# EasyEDA Pro project 官方红板.epro, board 2.0
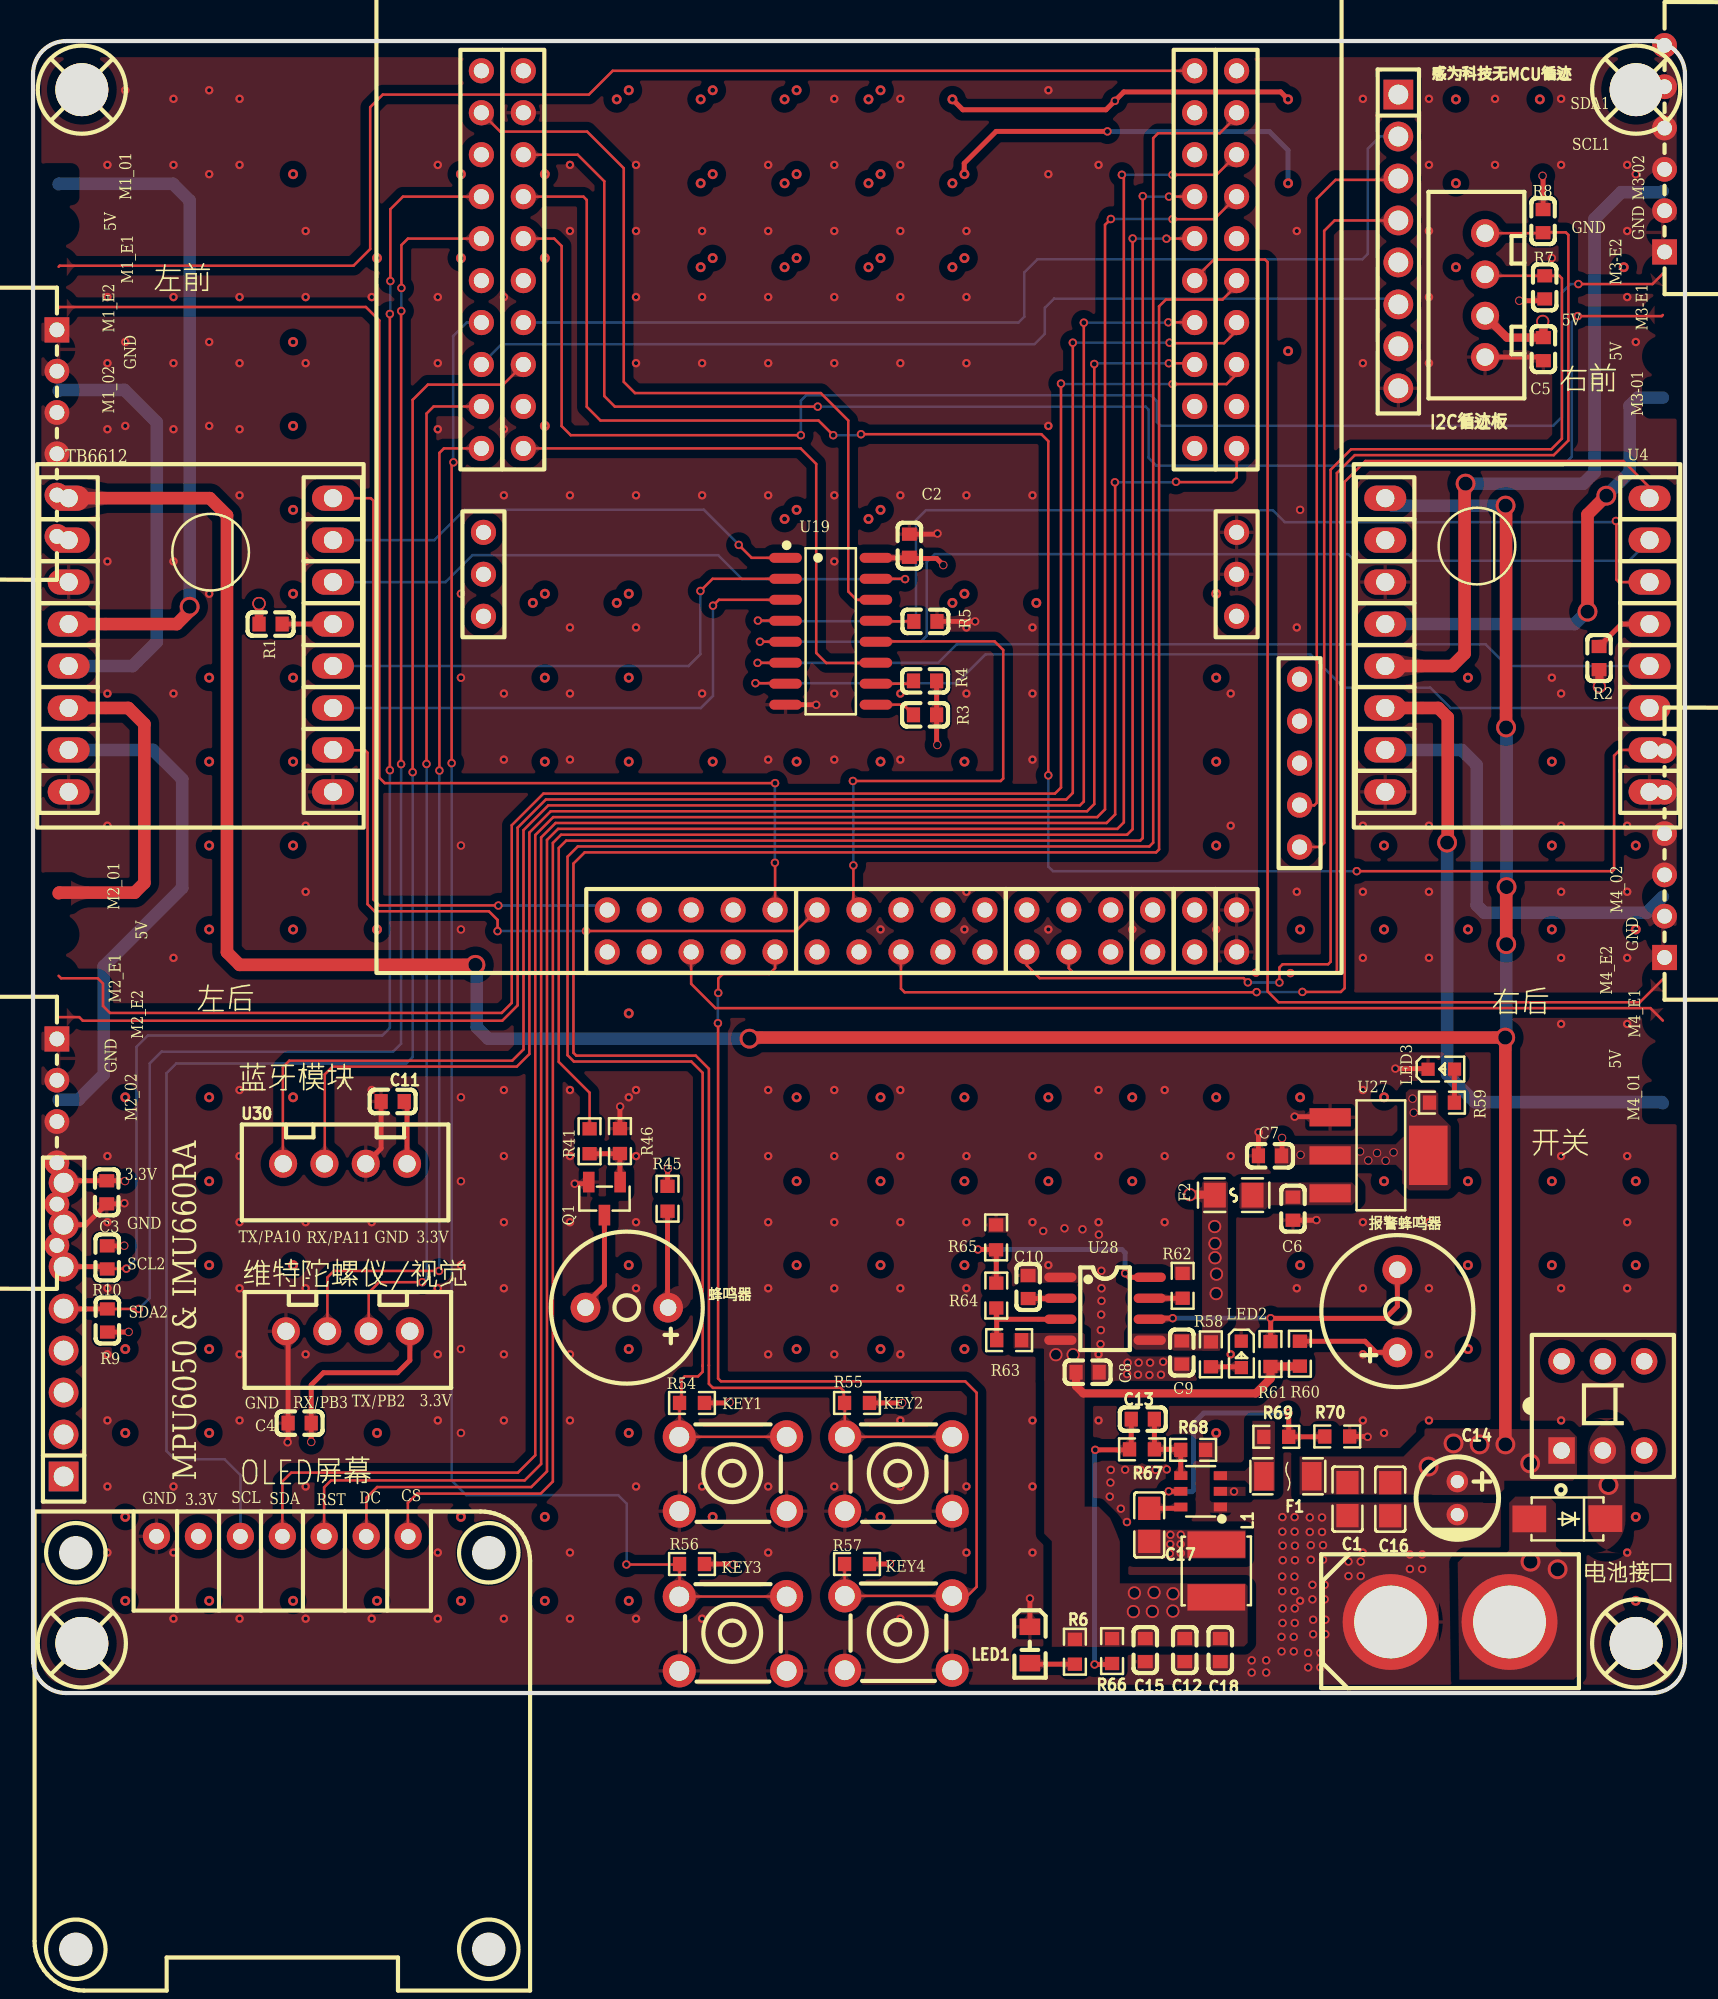
[diagram p1: board, top side]
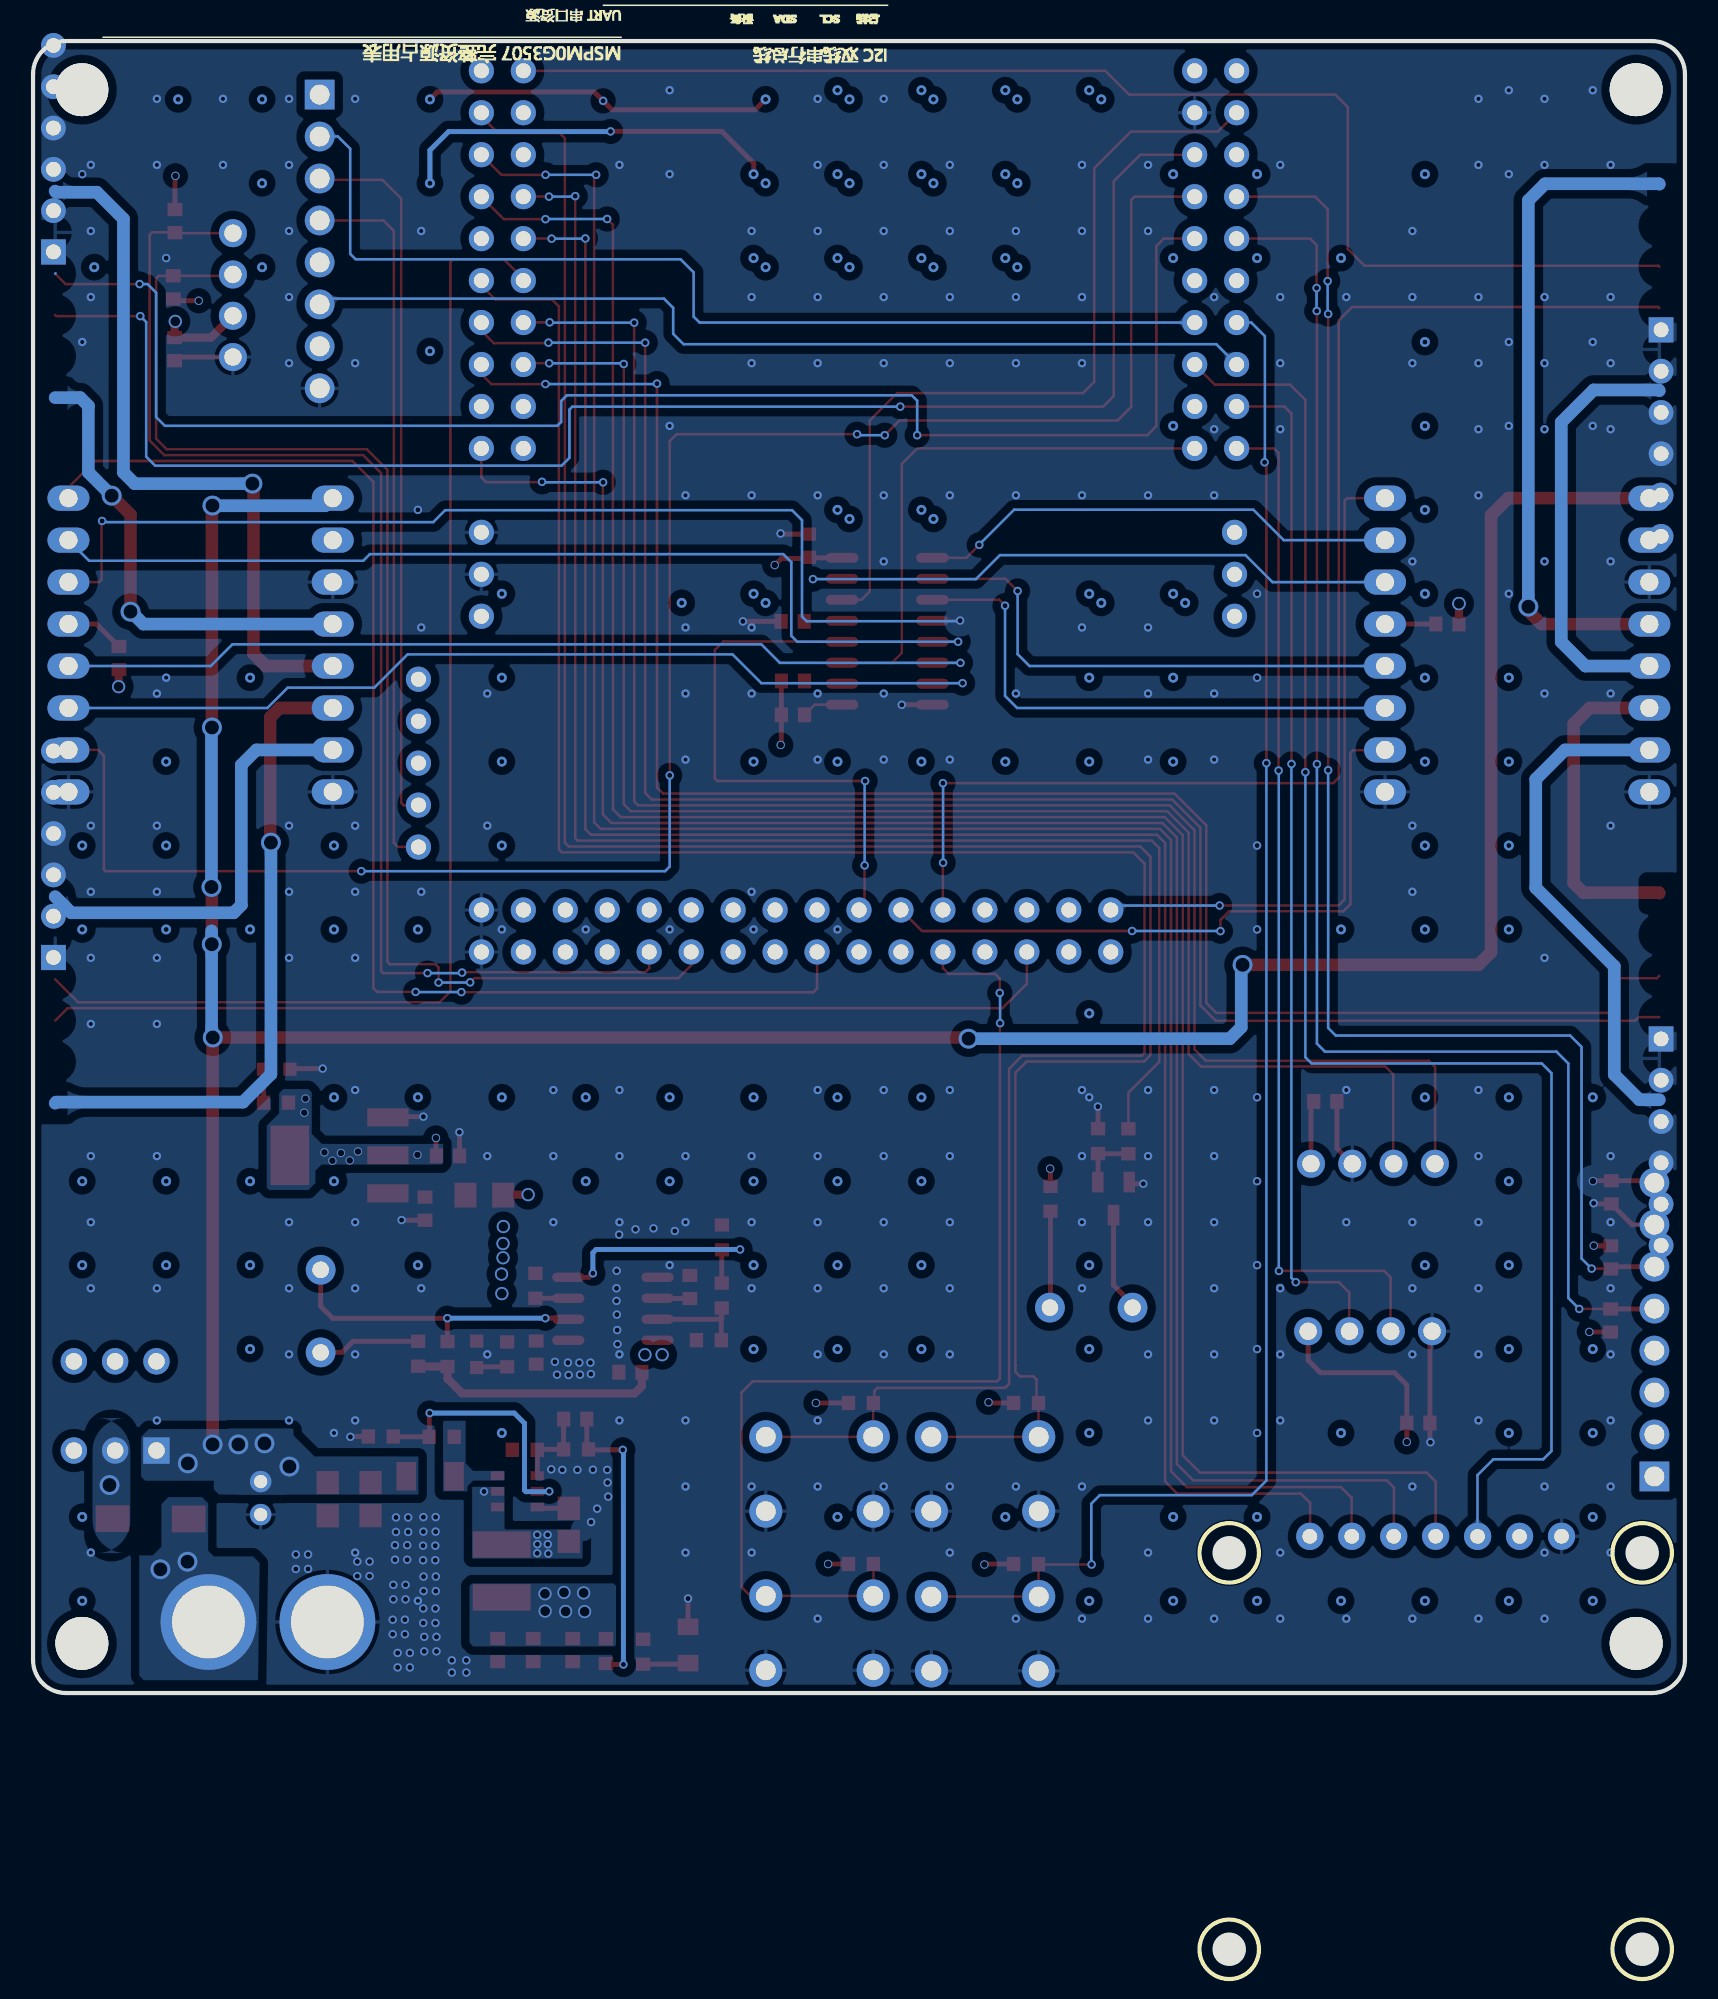
[diagram p2: board, bottom side, seen from below]

Outline 100 x 116.52 mm; copper layers: Top Layer, Inner1, Inner2, Bottom Layer. Coordinates in mm from the lower left corner of the outline.
Outline path: 0,114.52 0,18.52 arc(0.59,17.11) 2,16.52 98,16.52 arc(99.41,17.11) 100,18.52 100,114.52 arc(99.41,115.94) 98,116.52 2,116.52 arc(0.59,115.94) 0,114.52
Stack: Top Layer 0.035mm 外层铜厚1oz / Dielectric1 0.2104mm 7628 RC49% 8.6mil / Inner1 0.0152mm 内层铜厚 / Dielectric2 1.065mm 1.1mm H/HOZ 含铜 / Inner2 0.0152mm 内层铜厚 / Dielectric3 0.2104mm 7628 RC49% 8.6mil / Bottom Layer 0.035mm 外层铜厚1oz

## Design rules (mm)
net 5V: 5v
net 12V: 12v
net DC5V: 5v
net M2_O2: 12v
net M2_O1: 12v
net M1_O2: 12v
net M1_O1: 12v
net M4_O2: 12v
net M4_O1: 12v
net M3_O2: 12v
net M3_O1: 12v
net +3.3V: 3.3v
net DC12V: 12v
net $1N17140: 5v
net +12V: 12v
template: TI板
spacing copperThickness1oz (default): track to track 0.203, other pairs 0.152 to 0.203
spacing copperThickness2oz: track to track 0.203, other pairs 0.152 to 0.3
track width 信号线 (default): min 0.152, default 0.152, max 0.3
track width 12v: min 0.762, default 0.762, max 1.999
track width 3v3: min 0.3, default 0.3, max 0.3
track width 5电源线: min 0.5, default 0.5, max 0.5
differential pair differentialPair (default): width min 0.152, default 0.152, max 0.152; gap min 0.152, default 0.152
via 信号线孔 (default): diameter min 0.508, default 0.508, max 0.508; hole min 0.254, default 0.254, max 0.305
via 12v: diameter min 1.199, default 1.199, max 1.199; hole min 0.851, default 0.851, max 0.851
via 3v3: diameter min 0.5, default 0.5, max 0.599; hole min 0.3, default 0.399, max 0.5
via 5v电源: diameter min 0.8, default 0.8, max 10; hole min 0.599, default 0.599, max 6.299
net class 5v uses 5v电源, 5电源线
net class 12v uses 12v
net class 3.3v uses 3v3
net 5V uses 5v电源, 5电源线
net 12V uses 12v
net DC5V uses 5v电源, 5电源线
net M2_O2 uses 12v
net M2_O1 uses 12v
net M1_O2 uses 12v
net M1_O1 uses 12v
net M4_O2 uses 12v
net M4_O1 uses 12v
net M3_O2 uses 12v
net M3_O1 uses 12v
net +3.3V uses 3v3
net DC12V uses 12v
net $1N17140 uses 5v电源, 5电源线
net +12V uses 12v

## Placement (name value [footprint] x y rotation side)
BUZZER3  3kHz  [BUZ-TH_BD9.0-P5.00-D0.6-FD]  35.94 39.85 180 top
BUZZER4  3kHz  [BUZ-TH_BD9.0-P5.00-D0.6-FD]  82.59 39.64 90 top
C1  100nF  [C0805]  79.57 28.26 90 top
C2  100nF  [C0603]  53.05 85.97 90 top
C3  100nF  [C0603]  4.46 46.83 90 top
C4  100nF  [C0603]  16.14 32.86 180 top
C5  100nF  [C0603]  91.43 97.87 90 top
C6  100nF  [C0603]  76.27 45.84 90 top
C7  100nF  [C0603]  74.88 49.04 0 top
C8  100nF  [C0603]  63.84 35.94 180 top
C9  100nF  [C0603]  69.54 37.13 90 top
C10  1NF  [C0603]  60.24 41.1 270 top
C11  100nF  [C0603]  21.77 52.33 180 top
C12  22uF  [C0603]  69.72 19.12 90 top
C13  75pf  [C0603]  67.18 33.1 180 top
C14  47uF  [CAP-TH_BD5.0-P2.00-D0.8-FD]  86.22 28.32 270 top
C15  22uF  [C0603]  67.33 19.12 90 top
C16  10uF  [C0805]  82.16 28.25 90 top
C17  100nF  [C0805]  67.57 26.7 90 top
C18  0.1uF  [C0603]  71.87 19.12 90 top
D1  SS54  [SMA_L4.3-W2.6-LS5.0-FD]  92.88 27.07 0 top
F1  nSMD010  [F1206]  75.96 29.64 180 top
F2  SMD0805-050-24  [F0805]  72.68 46.66 0 top
H1  -  [HDR-TH_8P-P2.54-V-F-1]  1.85 38.52 90 top
KEY1  K3  [KEY-TH_4P-L6.0-W6.0-P4.50]  42.37 29.78 0 top
KEY2  K3  [KEY-TH_4P-L6.0-W6.0-P4.50]  52.39 29.78 0 top
KEY3  K3  [KEY-TH_4P-L6.0-W6.0-P4.50]  42.37 20.11 0 top
KEY4  K3  [KEY-TH_4P-L6.0-W6.0-P4.50]  52.39 20.15 0 top
L1  10uH  [IND-SMD_L4.0-W4.0]  71.63 23.91 270 top
LED1  -  [LED_0805]  60.34 19.38 270 top
LED2  -  [LED_0603]  73.15 36.97 270 top
LED3  -  [LED_0603]  85.3 54.29 0 top
Q1  AO3400A  [SOT-23-3_L2.9-W1.3-P1.90-LS2.4-BR]  34.59 46.45 90 top
R1  10K  [C0603]  14.38 81.23 180 top
R2  10K  [C0603]  94.8 79.17 270 top
R3  10K  [C0603]  54 75.73 0 top
R4  10K  [C0603]  54 77.79 0 top
R5  10K  [C0603]  54.02 81.39 0 top
R6  5K  [R0603]  63.07 19.02 90 top
R7  4.7K  [C0603]  91.51 101.61 90 top
R8  4.7K  [C0603]  91.41 105.62 270 top
R9  4.7K  [C0603]  4.5 39.07 90 top
R10  4.7K  [C0603]  4.49 42.89 270 top
R41  22R  [R0603]  33.69 49.92 90 top
R45  100R  [R0603]  38.41 46.44 270 top
R46  10K  [R0603]  35.53 49.93 270 top
R54  10K  [R0603]  39.89 34.08 180 top
R55  10K  [R0603]  49.88 34.08 180 top
R56  10K  [R0603]  39.89 24.33 180 top
R57  10K  [R0603]  49.88 24.33 180 top
R58  10K  [R0603]  71.3 37.02 90 top
R59  2k  [R0603]  85.29 52.26 180 top
R60  100R  [R0603]  76.69 37.06 90 top
R61  10K  [R0603]  74.91 37.04 90 top
R62  75K  [R0603]  69.59 41.17 90 top
R63  150K  [R0603]  59.09 37.88 180 top
R64  36K  [R0603]  58.31 40.58 90 top
R65  47K  [R0603]  58.3 44.1 270 top
R66  49.9  [R0603]  65.32 19.06 90 top
R67  100K  [R0603]  67.13 31.27 180 top
R68  13.3K  [R0603]  70.23 31.24 180 top
R69  511K  [R0603]  75.26 32.03 180 top
R70  105K  [R0603]  78.95 32.05 180 top
SCREW1  -  [M3螺丝]  2.95 19.53 0 top
SCREW2  -  [M3螺丝]  97.04 113.58 0 top
SCREW3  -  [M3螺丝]  97.04 19.53 0 top
SCREW4  -  [M3螺丝]  2.95 113.58 0 top
SW1  XKB8585-Z-150  [SW-TH_6P-L8.5-W8.5-P2.50-LS5.4-BL-1]  95.03 33.9 0 top
U3  -  [TB6612]  0.1 68.86 0 top
U4  -  [TB6612]  79.8 68.86 0 top
U11  OLED_SPI  [0.96OLED_7P]  15.09 26.01 0 top
U18  PCA9555  [CONN-TH_4P-P2.50-XH2.54-4P]  87.9 101.14 270 top
U19  74HC595D,118  [SOIC-16_L9.9-W3.9-P1.27-LS6.0-BL]  48.29 80.79 270 top
U21  UART1  [CONN-TH_4P-P2.50-XH2.54-4P]  19.06 38.42 0 top
U22  -  [ZX-XH2.54-6PWZ]  1.55 101.61 270 top
U23  -  [ZX-XH2.54-6PWZ]  1.55 58.69 270 top
U24  -  [ZX-XH2.54-6PWZ]  98.66 101.18 90 top
U25  -  [ZX-XH2.54-6PWZ]  98.66 58.47 90 top
U27  A1117-3.3  [SOT-223-3_L6.5-W3.4-P2.30-LS7.0-BR-1]  81.49 49.07 180 top
U28  TPS25921ADR  [SOIC-8_L5.0-W4.0-P1.27-LS6.0-BL]  64.9 39.78 270 top
U29  XT60  [CONN-TH_XT60]  85.78 20.82 0 top
U30  UART1  [CONN-TH_4P-P2.50-XH2.54-4P]  18.89 48.56 0 top
U31  -  [MSPM0G3507]  20.79 166.79 0 top
U34  TPS54302DDCT  [TSOT-23-6_L2.9-W1.6-P0.95-LS2.8-BR]  70.68 28.73 0 top
感为科技无MCU循迹  -  [HDR-TH_8P-P2.54-V-F-1]  82.65 104.39 270 top

## Footprints (pads in the part's own frame, mm; a bottom-side part is the same pattern mirrored in y, then rotated)
0.96OLED_7P
  round 1.651 hole 0.889: 1(-7.617,0.003) 2(-5.077,-0.003) 3(-2.538,-0.003) 4(0.003,0.005) 5(2.54,0) 6(5.08,0) 7(7.62,-0.003)
BUZ-TH_BD9.0-P5.00-D0.6-FD
  round 1.8 hole 1: 1(-2.5,0) 2(2.5,0)
C0603
  rect 0.8x0.9 smd: 1(-0.7,0) 2(0.7,0)
C0805
  rect 1.41x1.35 smd: 1(-1,0) 2(1,0)
CAP-TH_BD5.0-P2.00-D0.8-FD
  round 1.3 hole 0.8: 1(-1,0) 2(1,0)
CONN-TH_4P-P2.50-XH2.54-4P
  round 1.7 hole 1.05: 1(3.75,0) 2(1.25,0) 3(-1.25,0) 4(-3.75,0)
CONN-TH_XT60
  round 5.8 hole 4.4: 1(-3.6,0) 2(3.6,0)
F0805
  rect 1.335x1.5 smd: 1(-1.143,0) 2(1.143,0)
F1206
  rect 1.19x1.728 smd: 1(-1.445,0) 2(1.445,0)
HDR-TH_8P-P2.54-V-F-1
  rect 1.8x1.8 hole 1.2: 1(-8.89,0)
  round 1.8 hole 1.2: 2(-6.35,0) 3(-3.81,0) 4(-1.27,0) 5(1.27,0) 6(3.81,0) 7(6.35,0) 8(8.89,0)
IND-SMD_L4.0-W4.0
  rect 1.6x3.5 smd: 1(-1.6,0) 2(1.6,0)
KEY-TH_4P-L6.0-W6.0-P4.50
  round 2 hole 1.2: 1(-3.25,-2.25) 2(3.25,-2.25) 3(3.25,2.25) 4(-3.25,2.25)
LED_0603
  rect 0.8x0.8 smd: 1(-0.851,-0.01) 2(0.75,-0.005)
LED_0805
  rect 1x1.25 smd: 1(-1.15,0.005) 2(1.05,0.005)
M3螺丝
  round 3.2 hole 3.2: 1(0,0)
MSPM0G3507
  round 1.524 hole 0.914: 1(6.35,-52.07) 2(6.35,-54.61) 3(6.35,-57.15) 4(6.35,-59.69) 5(6.35,-62.23) 6(6.35,-64.77) 7(6.35,-67.31) 8(6.35,-69.85) 9(6.35,-72.39) 10(6.35,-74.93) 11(8.89,-52.07) 12(8.89,-54.61) 13(8.89,-57.15) 14(8.89,-59.69) 15(8.89,-62.23) 16(8.89,-64.77) 17(8.89,-67.31) 18(8.89,-69.85) 19(8.89,-72.39) 20(8.89,-74.93) 21(49.53,-52.07) 22(49.53,-54.61) 23(49.53,-57.15) 24(49.53,-59.69) 25(49.53,-62.23) 26(49.53,-64.77) 27(49.53,-67.31) 28(49.53,-69.85) 29(49.53,-72.39) 30(49.53,-74.93) 31(52.07,-52.07) 32(52.07,-54.61) 33(52.07,-57.15) 34(52.07,-59.69) 35(52.07,-62.23) 36(52.07,-64.77) 37(52.07,-67.31) 38(52.07,-69.85) 39(52.07,-72.39) 40(52.07,-74.93) 41(13.97,-102.87) 42(16.51,-102.87) 43(19.05,-102.87) 44(21.59,-102.87) 45(24.13,-102.87) 46(26.67,-102.87) 47(29.21,-102.87) 48(31.75,-102.87) 49(34.29,-102.87) 50(36.83,-102.87) 51(39.37,-102.87) 52(41.91,-102.87) 53(44.45,-102.87) 54(46.99,-102.87) 55(49.53,-102.87) 56(52.07,-102.87) 57(13.97,-105.41) 58(16.51,-105.41) 59(19.05,-105.41) 60(21.59,-105.41) 61(24.13,-105.41) 62(26.67,-105.41) 63(29.21,-105.41) 64(31.75,-105.41) 65(34.29,-105.41) 66(36.83,-105.41) 67(39.37,-105.41) 68(41.91,-105.41) 69(44.45,-105.41) 70(46.99,-105.41) 71(49.53,-105.41) 72(52.07,-105.41) 73(55.88,-88.9) 74(55.88,-91.44) 75(55.88,-93.98) 76(55.88,-96.52) 77(55.88,-99.06) 78(6.477,-80.01) 79(6.477,-82.55) 80(6.477,-85.09) 81(52.07,-80.01) 82(52.07,-82.55) 83(52.07,-85.09)
R0603
  rect 0.806x0.864 smd: 1(-0.753,0) 2(0.753,0)
SMA_L4.3-W2.6-LS5.0-FD
  rect 2.046x1.62 smd: 1(-2.304,-0.009) 2(2.304,0.009)
SOIC-8_L5.0-W4.0-P1.27-LS6.0-BL
  oval 0.569x1.95 smd: 1(-1.905,-2.705) 2(-0.635,-2.705) 3(0.635,-2.705) 4(1.905,-2.705) 5(1.905,2.705) 6(0.635,2.705) 7(-0.635,2.705) 8(-1.905,2.705)
SOIC-16_L9.9-W3.9-P1.27-LS6.0-BL
  oval 0.602x1.971 smd: 1(-4.445,-2.736) 2(-3.175,-2.736) 3(-1.905,-2.736) 4(-0.635,-2.736) 5(0.635,-2.736) 6(1.905,-2.736) 7(3.175,-2.736) 8(4.445,-2.736) 9(4.445,2.736) 10(3.175,2.736) 11(1.905,2.736) 12(0.635,2.736) 13(-0.635,2.736) 14(-1.905,2.736) 15(-3.175,2.736) 16(-4.445,2.736)
SOT-23-3_L2.9-W1.3-P1.90-LS2.4-BR
  rect 1.25x0.7 smd: 1(1,-0.95) 2(1,0.95) 3(-1,0)
SOT-223-3_L6.5-W3.4-P2.30-LS7.0-BR-1
  rect 2.5x1.1 smd: 1(2.97,-2.3) 2(2.97,0) 3(2.97,2.3)
  rect 2.34x3.6 smd: 2(-2.97,0)
SW-TH_6P-L8.5-W8.5-P2.50-LS5.4-BL-1
  rect 1.6x1.6 hole 1: 1(-2.5,-2.7)
  round 1.6 hole 1: 2(0,-2.7) 3(2.5,-2.7) 4(2.5,2.7) 5(0.001,2.7) 6(-2.5,2.7)
TB6612
  oval 2.54x1.524 hole 1.1: 1(2.057,19.988) 2(2.057,17.448) 3(2.057,14.908) 4(2.057,12.368) 5(2.057,9.828) 6(2.057,7.288) 7(2.057,4.748) 8(2.057,2.208) 9(18.057,2.208) 10(18.057,4.748) 11(18.057,7.288) 12(18.057,9.828) 13(18.057,12.368) 14(18.057,14.908) 15(18.057,17.448) 16(18.057,19.988)
TSOT-23-6_L2.9-W1.6-P0.95-LS2.8-BR
  rect 0.8x0.532 smd: 1(1.2,-0.95) 2(1.2,0) 3(1.2,0.95) 4(-1.2,0.95) 5(-1.2,0) 6(-1.2,-0.95)
ZX-XH2.54-6PWZ
  rect 1.524x1.5 hole 0.9: 1(2.575,-0.104)
  round 1.5 hole 0.9: 2(5.074,-0.104) 3(7.574,-0.104) 4(10.075,-0.104) 5(12.575,-0.104) 6(15.075,-0.104)

## Nets
As in the schematic, except:
5V: C5.2 C9.2 F2.1 R1.2 R2.2 R58.2 U3.2 U4.2 U18.2 U22.2 U23.2 U24.2 U25.2 U28.5 U31.11 U31.54 U31.83 感为科技无MCU循迹.7
GND: C1.1 C2.2 C3.1 C4.2 C5.1 C6.1 C7.1 C8.1 C9.1 C10.1 C11.2 C12.1 C14.2 C15.1 C16.1 C18.1 H1.7 KEY1.1 KEY1.2 KEY2.1 KEY2.2 KEY3.1 KEY3.2 KEY4.1 KEY4.2 LED1.1 LED2.1 LED3.1 Q1.2 R5.2 R46.1 R62.2 R65.1 R68.1 R70.1 U3.3 U3.8 U3.9 U4.3 U4.8 U4.9 U11.1 U18.1 U19.8 U21.4 U22.5 U23.5 U24.5 U25.5 U27.1 U28.1 U29.1 U30.2 U31.12 U31.56 U31.72 U31.81 U31.82 U34.1 感为科技无MCU循迹.8
GW_AD0: U31.8 感为科技无MCU循迹.6
GW_D0: U31.17 感为科技无MCU循迹.2
GW_D1: U31.76 感为科技无MCU循迹.3
GW_D2: U31.77 感为科技无MCU循迹.4

Pads without a net: H1 1 2 3 4; SCREW1 1; SCREW2 1; SCREW3 1; SCREW4 1; SW1 3 4 5 6; U31 1 3 6 16 19 22 23 29 30 31 35 39 42 43 44 48 49 50 51 52 53 55 57 58 60 62 63 65 66 69 70 71 73 74 75 78 79 80; 感为科技无MCU循迹 1 5

## Via types
v1: diameter 0.508, hole 0.305, Top Layer to Bottom Layer, 175 vias
v2: diameter 0.508, hole 0.254, Top Layer to Bottom Layer, 256 vias
v3: diameter 0.508, hole 0.3, Top Layer to Bottom Layer, 12 vias
v4: diameter 0.8, hole 0.6, Top Layer to Bottom Layer, 18 vias
v5: diameter 1.2, hole 0.85, Top Layer to Bottom Layer, 20 vias
v6: diameter 0.6, hole 0.3, Top Layer to Bottom Layer, 144 vias
v7: diameter 0.508, hole 0.4, Top Layer to Bottom Layer, 22 vias

## Routing (per net, layer and track width the routed paths; a pad name or vN(x,y) marks a point on that pad's centre or on a via; arc(x,y) is an arc through that point)
5V: length 329.2
  Top Layer w0.5: v4(94.82,77.44) 94.82,78.45 R2.2 ; R1.2 v4(13.68,82.47) ; v4(91.39,99.55) 91.43,99.51 C5.2 89.22,98.57 U18.2 ; F2.1 71.51,46.69 v4(70.03,46.69)
  Inner2 w0.5: v4(91.39,99.55) 91.39,97.51 ; 91.39,97.51 91.44,97.43 ; 91.39,97.51 91.39,97.43 91.44,97.43 ; 91.39,86.32 91.39,79.99 93.94,77.44 v4(94.82,77.44) ; 91.39,86.32 81.87,86.32 U4.2 76.97,86.31 76.37,85.71 76.37,83.3 74.82,81.75 72.91,81.75 U31.83 72.84,81.72 68.34,81.72 67.78,81.16 U31.54 69.08,62.62 69.08,58.58 70.03,57.63 v4(70.03,46.69) ; 91.39,86.32 91.39,86.34 ; 91.39,86.32 91.44,86.32 91.44,97.43 ; 13.64,105.35 1.56,105.35 1.55,105.36 ; 13.64,105.35 13.66,105.3 ; 13.64,105.35 13.66,105.35 ; 98.66,97.44 98.65,97.43 91.44,97.43 ; 6.09,86.25 2.22,86.25 U3.2 ; 6.09,86.25 13.67,86.25 ; 6.09,86.25 6.09,62.94 5.58,62.44 1.55,62.44 ; 13.67,86.25 13.68,86.25 v4(13.68,82.47) ; 13.67,86.25 13.68,86.2 ; 13.67,86.25 13.66,86.26 13.66,105.27 ; 13.66,105.35 13.66,105.3 ; 13.66,105.35 13.67,105.35 13.67,105.28 ; 13.66,105.35 13.65,105.36 13.65,112.1 14.99,113.44 28.4,113.44 U31.11 59.18,114.72 60.65,113.25 60.65,90.08 61.94,88.79 75.73,88.79 77.07,90.13 77.07,97 78.11,98.04 感为科技无MCU循迹.7 86.05,98.04 U18.2 ; 13.66,105.3 13.67,105.28 ; 13.66,105.3 13.66,105.27 ; 13.67,105.28 13.66,105.27 ; v4(71.55,43.73) 72.01,44.19 91.88,44.19 93.47,45.78 93.47,53.88 94.32,54.73 98.66,54.73
  vias: v4(71.53,44.76) v4(71.55,42.87) v4(71.64,41.88) v4(71.62,40.7)
12V: length 183.4
  Top Layer w0.762: 89.18,74.97 v5(89.17,74.97) 89.17,88.37 v5(89.14,88.4) ; v5(89.18,61.85) 89.18,65.29 v5(89.2,65.31) ; U3.1 10.7,88.85 11.74,87.81 11.74,61.36 12.5,60.6 v5(26.78,60.6) ; v5(89.13,31.57) 89.13,56.19 v5(89.12,56.2) 43.44,56.2 v5(43.37,56.13)
  Bottom Layer w0.762: v5(43.37,56.13) 27.55,56.13 26.86,56.82 26.86,60.52 v5(26.78,60.6) ; 89.08,88.59 89.08,88.6 88.87,88.39 82.31,88.39 U4.1 ; v5(89.12,56.2) 89.19,56.27 89.19,62.66 ; v5(89.17,74.97) 89.2,74.94 v5(89.2,65.31)
  vias: v5(84.48,30.23) v5(85.99,31.63) v5(87.57,31.57) v5(90.63,30.42)
+3.3V: length 87
  Top Layer w0.3: R3.2 54.7,73.95 v7(54.74,73.91) ; R10.1 5.51,43.59 v7(5.52,43.6) ; C2.1 53.02,85.24 U19.16 ; C7.2 75.61,49.07 v7(75.61,50.12) ; v7(42.16,34.12) 42.12,34.08 R54.1 ; U21.1 22.81,36.66 22.06,35.91 17.58,35.91 16.84,35.17 C4.1 v7(16.84,31.72) ; H1.8 1.97,47.53 C3.2 5.55,47.53 v7(5.57,47.51) ; U30.1 22.64,52.16 C11.1 ; R57.1 v7(51.87,24.33) ; v7(89.97,100.8) 91.4,100.8 R7.1 ; v7(91.38,108.36) 91.41,108.33 R8.1 ; v7(55.1,84.8) 54.7,85.2 53.06,85.2 ; R55.1 v7(52.61,34.08) ; v1(65.04,111.05) 58.3,111.05 56.37,109.12 56.37,108.48 v6(56.38,108.46) ; v6(75.97,112.99) 75.53,113.44 66.03,113.44 v1(65.49,112.9) 64.95,112.36 56.29,112.36 v6(55.66,112.99) ; v7(42.41,24.3) 42.38,24.33 R56.1 ; v7(5.79,38.38) 5.78,38.37 R9.1 ; R45.1 38.41,48.24 v7(38.43,48.26) ; R4.2 54.7,75.74
  Bottom Layer w0.3: v6(75.97,107.91) 75.97,109.91 74.84,111.04 65.05,111.04 v1(65.04,111.05) ; v7(5.57,47.51) 5.59,47.51
  vias: v6(5.58,52.58) v6(5.58,37.34) v6(5.58,32.26) v6(5.58,27.18) v6(5.58,22.1) v6(10.66,77.98) v6(10.66,72.9) v6(10.66,67.82) v6(10.66,62.74) v6(10.66,52.58) v6(10.66,47.5) v6(10.66,42.42) v6(10.66,37.34) v6(10.66,32.26) v6(10.66,22.1) v6(15.74,108.46) v6(15.74,98.3) v6(15.74,93.22) v6(15.74,88.14) v6(15.74,83.06) v6(15.74,77.98) v6(15.74,72.9) v6(15.74,67.82) v6(15.74,62.74) v6(15.74,52.58) v6(15.74,42.42) v6(15.74,22.1) v6(20.82,103.38) v6(20.82,62.74) v6(20.82,32.26) v6(20.82,22.1) v6(25.9,108.46) v6(25.9,103.38) v6(25.9,27.18) v6(25.9,22.1) v6(30.25,82.51) v6(30.98,108.46) v6(30.98,103.38) v6(30.98,93.22) v6(30.98,83.06) v6(30.98,77.98) v6(30.98,72.9) v6(30.98,27.18) v6(30.98,22.1) v6(35.34,112.99) v6(35.34,82.51) v6(36.06,113.54) v6(36.06,83.06) v6(36.06,77.98) v6(36.06,72.9) v6(36.06,57.66) v6(36.06,42.42) v6(36.06,37.34) v6(36.06,32.26) v6(36.06,22.1) v6(40.41,112.99) v6(40.41,107.91) v6(40.41,102.83) v6(41.14,113.54) v6(41.14,108.46) v6(41.14,103.38) v6(41.14,72.9) v6(41.14,27.18) v6(45.5,112.99) v6(45.5,107.91) v6(45.5,102.83) v6(45.5,87.59) v6(46.22,113.54) v6(46.22,108.46) v6(46.22,103.38) v6(46.22,88.14) v6(46.22,72.9) v6(46.22,52.58) v6(46.22,47.5) v6(46.22,42.42) v6(46.22,37.34) v6(50.57,112.99) v6(50.57,107.91) v6(50.57,102.83) v6(50.57,87.59) v6(51.3,113.54) v6(51.3,108.46) v6(51.3,103.38) v6(51.3,88.14) v6(51.3,72.9) v6(51.3,52.58) v6(51.3,47.5) v6(51.3,42.42) v6(51.3,37.34) v6(51.3,27.18) v6(55.66,107.91) v6(55.66,102.83) v6(55.66,82.51) v6(56.38,103.38) v6(56.38,83.06) v6(56.38,72.9) v6(56.38,52.58) v6(56.38,47.5) v6(56.38,42.42) v6(56.38,37.34) v6(60.74,82.51) v6(61.46,52.58) v6(61.46,47.5) v6(66.54,52.58) v6(66.54,47.5) v6(71.62,83.06) v6(71.62,77.98) v6(71.62,72.9) v6(71.62,67.82) v6(71.62,52.58) v6(71.62,32.26) v6(75.97,97.75) v6(76.7,62.74) v6(76.7,52.58) v6(76.7,42.42) v6(81.78,67.82) v6(81.78,62.74) v6(81.78,52.58) v6(81.78,47.5) v6(86.13,112.99) v6(86.13,107.91) v6(86.13,102.83) v6(86.86,77.98) v6(86.86,62.74) v6(86.86,47.5) v6(86.86,42.42) v6(86.86,37.34) v6(91.22,112.99) v6(91.94,72.9) v6(91.94,67.82) v6(91.94,62.74) v6(91.94,47.5) v6(91.94,42.42) v6(96.29,102.83) v6(97.02,67.82) v6(97.02,62.74) v6(97.02,47.5) v6(97.02,42.42) v6(97.02,27.18) v6(97.02,22.1) v7(76.73,49.1) v7(80.33,49.3) v7(80.83,48.76) v7(81.36,49.21) v7(81.88,48.74) v7(82.36,49.25) v7(83.51,52.5) v7(83.58,51.65)
+12V:
  vias: v5(95.37,29.11)
GND: length 36.8
  Top Layer w0.3: v1(80.79,32.03) 80.77,32.05 R70.1 ; v1(32.79,47.35) 33.54,47.35 Q1.2 ; C5.1 91.21,97.39 U18.1 ; v1(76.37,51.41) 78.48,51.41 U27.1 ; v1(35.54,52.02) 35.53,52.01 R46.1 ; v1(82.47,54.32) 84.41,54.32 LED3.1 ; R5.2 v1(57.03,81.39) ; v1(54.75,86.71) 54.71,86.67 C2.2 ; C11.2 21.07,49.49 U30.2 ; C6.1 77.68,45.14 v1(77.69,45.15) ; H1.7 3.2,44.87 C3.1 5.49,46.13 v1(5.53,46.17) ; v1(15.41,31.7) 15.44,31.73 C4.2 15.44,38.29 U21.4 ; v1(74.19,50.47) 74.18,50.46 C7.1 ; v1(47.41,76.34) 47.4,76.35 U19.8 ; LED1.1 60.35,20.54 v1(60.35,22.24)
  Bottom Layer w0.3: v1(32.79,47.35) 32.78,47.34 ; v1(60.35,22.24) 60.33,22.24
  vias: v1(61.15,44.49) v1(62.44,44.65) v1(63.53,44.59) v1(64.52,44.27) v1(64.64,38.49) v1(64.62,37.64) v1(64.67,42.08) v1(64.68,41.02) v1(64.68,40.26) v1(64.66,39.43) v1(65.24,30.03) v1(65.22,29.26) v1(65.18,28.41) v1(65.85,27.68) v1(66.11,30.04) v1(66.23,35.83) v1(66.22,26.87) v1(66.26,36.52) v1(66.93,36.52) v1(66.89,35.79) v1(67.05,30.03) v1(67.62,36.52) v1(67.58,35.77) v1(67.96,30.03) v1(68.28,35.79) v1(68.41,36.57) v1(68.63,30.06) v1(73.77,18.5) v1(73.77,17.76) v1(74.65,18.5) v1(74.65,17.76) v1(75.63,27.17) v1(75.63,26.29) v1(75.62,23.57) v1(75.62,22.69) v1(75.64,21.64) v1(75.64,20.76) v1(75.58,19.92) v1(75.58,19.04) v1(75.65,25.44) v1(75.65,24.56) v1(76.32,19.92) v1(76.32,19.04) v1(76.37,27.17) v1(76.37,26.29) v1(76.39,25.44) v1(76.39,24.56) v1(76.36,23.57) v1(76.36,22.69) v1(76.38,21.64) v1(76.38,20.76) v1(77.19,18.95) v1(77.19,18.07) v1(77.29,27.15) v1(77.29,26.27) v1(77.35,25.47) v1(77.35,24.59) v1(77.45,23.07) v1(77.45,22.19) v1(77.49,20.96) v1(77.49,20.08) v1(77.93,18.95) v1(77.93,18.07) v1(78.03,27.15) v1(78.03,26.27) v1(78.09,25.47) v1(78.09,24.59) v1(78.19,23.07) v1(78.19,22.19) v1(78.23,20.96) v1(78.23,20.08) v1(79.63,24.48) v1(79.63,23.6) v1(80.37,24.48) v1(80.37,23.6) v1(83.35,24.91) v1(83.35,24.03) v1(84.09,24.91) v1(84.09,24.03) v2(4.5,109.02) v2(4.5,101.02) v2(4.5,97.02) v2(4.5,93.02) v2(4.5,85.02) v2(4.5,77.02) v2(4.5,69.02) v2(4.5,49.02) v2(4.5,45.02) v2(4.5,41.02) v2(4.5,37.02) v2(4.5,33.02) v2(4.5,29.02) v2(4.5,25.02) v2(5.58,113.54) v2(5.58,98.3) v2(5.58,93.22) v2(8.5,113.02) v2(8.5,109.02) v2(8.5,101.02) v2(8.5,97.02) v2(8.5,93.02) v2(8.5,85.02) v2(8.5,77.02) v2(8.5,61.02) v2(8.5,29.02) v2(8.5,25.02) v2(8.5,21.02) v2(10.66,113.54) v2(10.66,108.46) v2(10.66,98.3) v2(10.66,93.22) v2(10.66,83.06) v2(12.5,113.02) v2(12.5,109.02) v2(12.5,101.02) v2(12.5,97.02) v2(12.5,93.02) v2(12.5,89.02) v2(12.5,53.02) v2(12.5,49.02) v2(12.5,45.02) v2(12.5,41.02) v2(12.5,37.02) v2(12.5,33.02) v2(12.5,21.02) v2(16.5,105.02) v2(16.5,101.02) v2(16.5,97.02) v2(16.5,85.02) v2(16.5,69.02) v2(16.5,65.02) v2(16.5,45.02) v2(16.5,41.02) v2(16.5,37.02) v2(16.5,29.02) v2(16.5,21.02) v2(20.5,101.02) v2(20.5,53.02) v2(20.5,45.02) v2(20.5,21.02) v2(24.5,109.02) v2(24.5,101.02) v2(24.5,97.02) v2(24.5,93.02) v2(24.5,41.02) v2(24.5,37.02) v2(24.5,33.02) v2(24.5,25.02) v2(24.5,21.02) v2(28.5,101.02) v2(28.5,93.02) v2(28.5,89.02) v2(28.5,77.02) v2(28.5,73.02) v2(28.5,53.02) v2(28.5,49.02) v2(28.5,45.02) v2(28.5,41.02) v2(28.5,37.02) v2(28.5,33.02) v2(28.5,21.02) v2(32.5,109.02) v2(32.5,105.02) v2(32.5,89.02) v2(32.5,81.02) v2(32.5,77.02) v2(32.5,73.02) v2(32.5,53.02) v2(32.5,49.02) v2(32.5,45.02) v2(32.5,37.02) v2(32.5,33.02) v2(32.5,25.02) v2(32.5,21.02) v2(36.06,52.58) v2(36.5,109.02) v2(36.5,105.02) v2(36.5,101.02) v2(36.5,97.02) v2(36.5,89.02) v2(36.5,81.02) v2(36.5,53.02) v2(36.5,49.02) v2(36.5,45.02) v2(36.5,41.02) v2(36.5,29.02) v2(36.5,21.02) v2(40.5,105.02) v2(40.5,101.02) v2(40.5,97.02) v2(40.5,89.02) v2(40.5,77.02) v2(40.5,29.02) v2(40.5,21.02) v2(44.5,109.02) v2(44.5,105.02) v2(44.5,101.02) v2(44.5,97.02) v2(44.5,89.02) v2(44.5,73.02) v2(44.5,53.02) v2(44.5,49.02) v2(44.5,45.02) v2(44.5,41.02) v2(44.5,37.02) v2(44.5,29.02) v2(44.5,25.02) v2(48.5,113.02) v2(48.5,109.02) v2(48.5,105.02) v2(48.5,101.02) v2(48.5,97.02) v2(48.5,89.02) v2(48.5,85.02) v2(48.5,77.02) v2(48.5,73.02) v2(48.5,53.02) v2(48.5,49.02) v2(48.5,45.02) v2(48.5,41.02) v2(48.5,37.02) v2(48.5,29.02) v2(51.3,62.74) v2(52.5,113.02) v2(52.5,109.02) v2(52.5,105.02) v2(52.5,101.02) v2(52.5,97.02) v2(52.5,89.02) v2(52.5,77.02) v2(52.5,73.02) v2(52.5,53.02) v2(52.5,49.02) v2(52.5,45.02) v2(52.5,41.02) v2(52.5,37.02) v2(52.5,33.02) v2(52.5,29.02) v2(52.5,21.02) v2(56.38,62.74) v2(56.5,105.02) v2(56.5,101.02) v2(56.5,97.02) v2(56.5,89.02) v2(56.5,81.02) v2(56.5,77.02) v2(56.5,65.02) v2(56.5,49.02) v2(56.5,45.02) v2(56.5,41.02) v2(56.5,29.02) v2(56.5,25.02) v2(60.5,89.02) v2(60.5,81.02) v2(60.5,77.02) v2(60.5,73.02) v2(60.5,49.02) v2(60.5,45.02) v2(60.5,33.02) v2(60.5,29.02) v2(60.5,25.02) v2(61.46,113.54) v2(61.46,108.46) v2(61.46,93.22) v2(61.46,62.74) v2(61.46,42.42) v2(64.5,109.02) v2(64.5,53.02) v2(64.5,49.02) v2(64.5,45.02) v2(64.5,37.02) v2(64.5,33.02) v2(66.54,62.74) v2(68.5,53.02) v2(68.5,49.02) v2(68.5,45.02) v2(71.62,62.74) v2(72.5,77.02) v2(72.5,69.02) v2(72.5,49.02) v2(72.5,37.02) v2(76.5,105.02) v2(76.5,81.02) v2(76.5,65.02) v2(76.5,41.02) v2(76.7,22.1) v2(80.5,113.02) v2(80.5,97.02) v2(80.5,69.02) v2(80.5,65.02) v2(80.5,61.02) v2(80.5,53.02) v2(80.5,45.02) v2(80.5,41.02) v2(80.5,37.02) v2(80.5,33.02) v2(80.5,25.02) v2(81.78,32.26) v2(84.5,113.02) v2(84.5,109.02) v2(84.5,105.02) v2(84.5,101.02) v2(84.5,97.02) v2(84.5,69.02) v2(84.5,65.02) v2(84.5,61.02) v2(84.5,45.02) v2(84.5,41.02) v2(84.5,37.02) v2(84.5,33.02) v2(88.5,113.02) v2(88.5,109.02) v2(91.94,77.98) v2(92.5,113.02) v2(92.5,109.02) v2(92.5,77.02) v2(92.5,69.02) v2(92.5,65.02) v2(92.5,61.02) v2(92.5,57.02) v2(92.5,49.02) v2(92.5,41.02) v2(92.5,33.02) v2(96.5,109.02) v2(96.5,105.02) v2(96.5,101.02) v2(96.5,69.02) v2(96.5,65.02) v2(96.5,61.02) v2(96.5,57.02) v2(96.5,49.02) v2(96.5,45.02) v2(96.5,41.02) v2(96.5,25.02) v2(97.02,98.3) v3(25.9,83.06) v3(25.9,77.98) v3(25.9,67.82) v3(25.9,62.74) v3(25.9,52.58) v3(25.9,47.5) v3(25.9,42.42) v3(25.9,37.34) v3(25.9,32.26) v3(76.7,88.14) v3(91.94,103.38) v3(97.02,108.46)
595DS: length 49.7
  Top Layer w0.153: U31.2 28.28,111.04 33.54,111.04 35.76,108.82 35.76,95.89 36.44,95.21 47.69,95.21 49.35,93.55 49.35,83.2 49.85,82.7 U19.14
595SHCP: length 33.4
  Top Layer w0.153: U19.11 51.01,78.87 48.02,78.87 47.41,79.48 47.41,90.92 46.47,91.86 U31.20
595STCP: length 32.8
  Top Layer w0.153: U31.47 49.66,64.26 v1(49.66,66.62) ; U19.12 51.05,80.18 58.21,80.18 58.73,79.66 58.73,71.88 58.58,71.73 v1(49.63,71.73)
  Bottom Layer w0.153: v1(49.63,71.73) 49.66,71.7 v1(49.66,66.62)
BEEP: length 95.4
  Top Layer w0.153: v1(67.18,107.13) 67.18,107.13 67.18,68.27 67.02,68.12 32.27,68.12 31.82,67.67 31.82,54.73 33.69,52.86 R41.2 ; v1(68.76,107.1) 70.32,107.1 U31.24
  Bottom Layer w0.153: v1(68.76,107.1) 67.21,107.1 v1(67.18,107.13)
DC5V: length 15.7
  Top Layer w0.5: 76.69,36.31 76.67,36.29 74.91,36.29 74.91,35.55 74.02,34.66 63.58,34.66 63.14,35.1 C8.2
  vias: v4(61.92,37) v4(62.96,37) v4(66.61,21.45) v4(66.67,22.58) v4(67.76,21.46) v4(67.86,22.61) v4(69.01,22.53) v4(69,21.48)
DC12V:
  vias: v5(90.65,24.47) v5(92.29,24.01)
EN: length 16
  Top Layer w0.3: v1(68.75,28.73) U34.5 ; R70.2 78.18,32.03 76.01,32.03 76.01,33.45 v1(75.99,33.47)
  Bottom Layer w0.3: v1(75.99,33.47) 70.87,33.47 70.25,32.85 70.25,28.8 70.16,28.71 68.77,28.71 v1(68.75,28.73)
ENUV: length 6.4
  Top Layer w0.3: U28.3 58.34,39.15 58.34,39.15 ; 58.34,39.15 58.31,39.18 ; 58.34,39.15 58.34,39.24 ; 58.34,39.15 R63.2 ; 58.34,39.24 58.31,39.27 58.31,39.83 58.34,39.8 58.34,39.24
FB: length 5
  Top Layer w0.3: C13.1 67.88,33.1 R67.1 69.45,31.27 R68.2 69.48,29.68 U34.4
GW_AD0: length 58.2
  Bottom Layer w0.153: 感为科技无MCU循迹.6 82.3,100.93 61.81,100.93 61.25,100.37 61.25,98.8 60.62,98.17 28.37,98.17 U31.8
GW_D0: length 62.9
  Bottom Layer w0.153: 感为科技无MCU循迹.2 82.64,110.75 81.55,110.75 80.8,110 80.8,103.64 80.47,103.31 60.8,103.31 60.01,102.52 60.01,99.84 59.65,99.48 U31.17
GW_D1: length 43.1
  Top Layer w0.153: 76.68,70.25 77.56,70.25 77.71,70.4 77.71,106.98 78.85,108.12 82.57,108.12 感为科技无MCU循迹.3
GW_D2: length 43.4
  Top Layer w0.153: 感为科技无MCU循迹.4 78.79,105.66 78.16,105.03 78.16,67.99 77.91,67.74 76.72,67.74 76.69,67.77
KEY1: length 134.4
  Top Layer w0.153: 40.53,36.31 40.53,36.37 ; 40.53,36.31 40.53,54.07 39.85,54.75 32.74,54.75 32.36,55.13 32.36,67.15 32.98,67.77 67.58,67.77 67.81,68 67.81,110.65 68.11,110.94 71.84,110.94 72.83,111.93 ; 40.53,36.31 40.53,35.96 ; 40.53,35.96 40.26,35.69 39.45,35.69 39.26,35.5 39.26,33.97 ; KEY1.3 KEY1.4 39.14,32.05 R54.2
KEY2: length 130.7
  Top Layer w0.153: 40.92,54.31 40.12,55.1 32.89,55.1 32.71,55.28 32.71,66.73 33.39,67.41 67.99,67.41 68.16,67.59 68.16,100.46 68.58,100.87 72.01,100.87 72.86,101.72 72.86,101.72 ; 40.91,36.36 40.91,35.24 41.16,34.99 48.89,34.99 49.07,34.81 49.07,34.09 ; 40.91,36.36 40.91,36.36 ; 40.91,36.36 40.91,54.31 ; R55.2 49.14,34.07 KEY2.4 KEY2.3
KEY3: length 97.9
  Top Layer w0.153: v1(35.92,24.3) 39.14,24.3 ; 39.14,24.3 R56.2 ; 39.14,24.3 39.14,22.38 KEY3.4 KEY3.3 ; v1(25.45,91.02) 25.34,90.91 v1(25.34,72.81)
  Bottom Layer w0.153: v1(25.34,72.81) 25.34,29.38 26.22,28.5 35.42,28.5 35.94,27.98 35.94,24.32 v1(35.92,24.3) ; U31.7 26.25,99.48 25.43,98.66 25.43,91.04 v1(25.45,91.02)
KEY4: length 66.8
  Top Layer w0.153: U31.61 44.92,60.4 44.57,60.05 41.76,60.05 41.48,59.77 v1(41.48,58.9) ; v1(41.46,57.07) 41.47,57.06 41.47,35.56 41.64,35.39 56.43,35.39 57.12,34.7 57.12,22.95 56.57,22.4 KEY4.3 KEY4.4 49.13,22.41 R57.2
  Bottom Layer w0.153: v1(41.48,58.9) 41.46,58.88 v1(41.46,57.07)
M1_E1: length 78.7
  Top Layer w0.153: 1.55,102.86 1.61,102.92 19.4,102.92 20.41,103.93 20.41,112.52 21.17,113.28 33.65,113.28 35.09,114.72 U31.21
M1_E2: length 79.2
  Top Layer w0.153: v1(44.92,71.6) 21.29,71.6 20.96,71.93 20.96,99.61 20.15,100.42 1.61,100.42 1.55,100.36 ; v1(44.91,66.78) 44.92,66.77 U31.45
  Bottom Layer w0.153: v1(44.92,71.6) 44.91,71.59 v1(44.91,66.78)
M1_IN1: length 37.7
  Top Layer w0.153: v1(52.79,83.95) 52.77,83.97 U19.15
  Bottom Layer w0.153: v1(52.79,83.95) 42.92,83.95 41.47,85.4 26.6,85.4 24.97,83.77 U3.14
M1_IN2: length 29.4
  Top Layer w0.153: v1(42.72,86.02) 43.5,85.24 U19.1
  Bottom Layer w0.153: v1(42.72,86.02) 42.72,86.04 40.61,88.15 26.13,88.15 24.29,86.31 U3.15
M1_O1: length 40.9
  Top Layer w0.762: U3.4 8.7,81.23 9.48,82.01 v5(9.48,82.28)
  Bottom Layer w0.762: v5(9.48,82.28) 9.48,106.87 8.47,107.88 1.57,107.88 1.55,107.86
M1_O2: length 26
  Bottom Layer w0.762: 1.55,95.36 1.59,95.4 5.53,95.4 7.49,93.44 7.49,80.15 6.03,78.69 U3.5
M1_PWM: length 41.1
  Top Layer w0.153: U3.16 20.45,88.85 20.61,88.7 20.61,64.56 20.96,64.2 28.16,64.2 v1(28.17,64.19)
  Bottom Layer w0.153: U31.41 34.49,64.19 v1(28.17,64.19)
M2_E1: length 109.9
  Top Layer w0.153: v1(68.98,95.76) 72.25,95.76 72.99,96.5 ; 1.55,59.94 1.7,59.79 3.92,59.79 4.23,59.47 4.23,58.11 4.66,57.69 28.37,57.69 28.98,58.3 28.98,69.05 30.89,70.97 61.86,70.97 62.23,71.33 v1(62.23,95.78)
  Bottom Layer w0.153: v1(62.23,95.78) 62.25,95.76 v1(68.98,95.76)
M2_E2: length 111.4
  Top Layer w0.153: 1.55,57.44 2.8,57.44 3.02,57.22 28.4,57.22 29.33,58.15 29.33,68.9 31.04,70.61 62.55,70.61 62.94,71.01 v1(62.94,98.26) ; 73.14,99.27 72.1,98.23 68.83,98.23 v1(68.8,98.26)
  Bottom Layer w0.153: 68.79,98.27 v1(68.8,98.26) v1(62.94,98.26)
M2_IN1: length 31.8
  Top Layer w0.153: U19.2 41.14,83.97 v1(40.4,83.23)
  Bottom Layer w0.153: U3.12 39.68,78.69 40.4,79.41 v1(40.4,83.23)
M2_IN2: length 33.3
  Top Layer w0.153: v1(41.16,82.34) 41.52,82.7 U19.3
  Bottom Layer w0.153: U3.11 40.43,76.15 41.16,76.88 v1(41.16,82.34)
M2_O1: length 20.1
  Top Layer w0.762: U3.6 5.77,76.15 6.74,75.18 6.74,65.56 6.15,64.97 1.59,64.97 1.55,64.94
M2_O2: length 30.8
  Bottom Layer w0.762: 1.55,52.44 2.75,52.44 4.28,53.96 4.28,60.51 9.03,65.26 9.03,71.84 7.26,73.61 U3.7
M2_PWM: length 40.1
  Top Layer w0.153: v1(33.47,62.65) 46.19,62.65 U31.46 ; U3.10 18.17,73.59 20.1,73.59 20.25,73.44 20.25,64.27 20.68,63.85 27.6,63.85 28.12,63.32 v1(28.12,62.64)
  Bottom Layer w0.153: v1(33.47,62.65) 28.13,62.65 v1(28.12,62.64)
M3_E1: length 94.7
  Top Layer w0.153: v1(93.51,99.87) 98.59,99.87 98.66,99.94 ; U31.13 32.97,109.64 34.58,108.03 34.58,95.03 35.22,94.39 47.49,94.39
  Bottom Layer w0.153: 93.52,99.88 93.15,99.51 93.15,91.36 92.61,90.82 68,90.82 67.53,91.29 67.53,94.21 67.35,94.39 v1(47.5,94.39)
M3_E2: length 92.2
  Top Layer w0.153: 98.66,102.44 98.03,101.81 v1(93.55,101.81) ; 46.42,92.64 46.4,92.66 32.55,92.66 32,93.21 32,104.11 31.55,104.56 U31.15
  Bottom Layer w0.153: 93.54,101.81 93.07,101.81 92.55,101.29 92.55,93.76 92.02,93.23 68.26,93.23 68.03,93.46 68.03,94.73 67.68,95.08 46.81,95.08 46.48,94.75 v1(46.48,92.66) ; 98.64,102.46 98.66,102.44
M3_IN1: length 65.8
  Top Layer w0.153: U4.14 96,83.77 95.85,83.92 95.85,87.44 v1(95.82,87.47) ; U19.4 45.54,81.44 v1(43.88,81.44)
  Bottom Layer w0.153: v1(95.82,87.47) 95.75,87.4 75.77,87.4 75.05,88.12 54.05,88.12 53.45,87.52 53.45,81.68 53.17,81.4 43.92,81.4 v1(43.88,81.44)
M3_IN2: length 60.9
  Top Layer w0.153: U19.5 45.55,80.16 v1(44,80.16)
  Bottom Layer w0.153: v1(44,80.16) 53.74,80.16 54.1,80.52 54.1,84.98 54.58,85.46 79.61,85.46 80.01,85.06 96.61,85.06 U4.15
M3_O1: length 28.3
  Top Layer w0.762: v5(94.1,81.98) 94.1,87.86 v5(95.24,89)
  Bottom Layer w0.762: 98.66,94.94 97.15,94.94 96.65,94.44 96.65,90.41 v5(95.24,89) ; U4.4 93.32,81.23 94.07,81.98
M3_O2: length 43.7
  Top Layer w0.762: v5(86.72,89.73) 86.66,89.67 86.66,79.44 85.91,78.69 U4.5
  Bottom Layer w0.762: v5(86.72,89.73) 93.85,89.73 94.53,90.41 94.53,105.76 96.14,107.37 98.59,107.37 98.66,107.44
M3_PWM: length 80.2
  Top Layer w0.153: U4.16 97.86,89.5 96.26,91.1 80.66,91.1 79.4,89.84 79.4,59.19 79.17,58.96 v1(76.84,58.96) ; v1(74.07,58.95) 74.06,58.94 52.76,58.94 52.54,59.16 U31.64
  Bottom Layer w0.153: v1(76.84,58.96) 76.83,58.95 v1(74.07,58.95)
M4_E1: length 61.7
  Top Layer w0.153: 98.66,57.23 97.91,57.98 41.31,57.98 39.84,59.45 U31.59
M4_E2: length 74.2
  Top Layer w0.153: 70.12,101.93 71.48,103.3 74.58,103.3 74.74,103.14 74.74,58.99 75.39,58.34 97.27,58.34 98.66,59.73
M4_IN1: length 56.7
  Top Layer w0.153: U19.6 45.54,78.88 v1(43.86,78.88)
  Bottom Layer w0.153: v1(43.86,78.88) 54.79,78.88 55.91,80 87.93,80 89.24,78.69 U4.12
M4_IN2: length 58
  Top Layer w0.153: v1(43.73,77.65) 45.52,77.65 U19.7
  Bottom Layer w0.153: U4.11 85.81,76.15 84.58,77.38 79.34,77.38 77.33,79.39 57.65,79.39 55.91,77.65 v1(43.73,77.65)
M4_O1: length 39.4
  Top Layer w0.762: U4.6 85.07,76.15 85.64,75.58 85.64,68.04 v5(85.6,68)
  Bottom Layer w0.762: v5(85.6,68) 85.6,53.98 87.29,52.29 98.6,52.29 98.66,52.23
M4_O2: length 26.3
  Bottom Layer w0.762: U4.7 86.48,73.61 87.39,72.7 87.39,64.22 87.86,63.75 97.68,63.75 98.66,64.73
M4_PWM: length 114.6
  Top Layer w0.153: U31.14 33.32,107.1 33.52,106.9 33.52,94.38 34.35,93.55 47.55,93.55 48.42,92.68 48.45,92.68 48.46,92.69 ; v1(80.13,66.27) 95.61,66.27 95.71,66.37 95.71,73.26 96.06,73.61 U4.10 ; v1(61.46,72.07) 61.46,92.3 61.04,92.72 v1(50.12,92.72)
  Bottom Layer w0.153: v1(50.12,92.72) 50.06,92.66 v1(48.44,92.66) ; v1(61.46,72.07) 61.46,66.55 61.74,66.27 v1(80.13,66.27)
OLED_CS: length 125
  Top Layer w0.153: U11.7 22.69,26.02 22.69,28.03 23.25,28.59 30.73,28.59 31.47,29.33 31.47,67.98 31.96,68.48 66.23,68.48 66.56,68.81 v1(66.56,104.57) ; 68.61,104.56 U31.25
  Bottom Layer w0.153: v1(66.56,104.57) 66.57,104.56 v1(68.61,104.56)
OLED_DC: length 134.2
  Top Layer w0.153: v1(68.98,108.43) 71.65,108.43 U31.33 ; v1(65.91,108.43) 66.03,108.31 66.03,69.22 65.64,68.83 31.78,68.83 31.11,68.16 31.11,29.94 30.16,28.99 20.83,28.99 20.18,28.34 20.18,26.02 U11.6
  Bottom Layer w0.153: 65.91,108.43 v1(68.98,108.43)
OLED_RST: length 119.3
  Top Layer w0.153: U11.5 17.62,26.02 17.62,28.97 18.04,29.39 29.76,29.39 30.76,30.39 30.76,68.31 31.63,69.19 64.99,69.19 65.51,69.71 65.51,89.79 v1(65.49,89.81) ; v1(69.19,89.84) 69.21,89.82 72.58,89.82 72.86,90.1 U31.40
  Bottom Layer w0.153: v1(69.19,89.84) 69.16,89.81 v1(65.49,89.81)
OLED_SCL: length 94.3
  Top Layer w0.153: U31.18 28.46,95.72 23.9,95.72 22.98,94.8 v1(22.98,72.26)
  Bottom Layer w0.153: v1(22.98,72.26) 22.98,55.01 22.6,54.63 8.67,54.63 8.08,54.04 8.08,31.17 8.58,30.67 11.6,30.67 12.56,29.71 12.56,26.01 U11.3
OLED_SDA: length 136
  Top Layer w0.153: v1(65.25,105.75) 64.89,105.4 64.89,70.02 64.42,69.54 31.49,69.54 30.4,68.46 30.4,30.91 29.35,29.86 15.63,29.86 15.09,29.32 U11.4 ; U31.34 71.5,105.74 v1(68.98,105.74)
  Bottom Layer w0.153: v1(65.25,105.75) 68.97,105.75 v1(68.98,105.74)
OVP: length 15
  Top Layer w0.3: v1(66.11,41.93) 66.35,41.69 U28.8 ; R64.2 58.31,43.34 58.28,43.37 v1(57.2,43.37)
  Bottom Layer w0.3: v1(57.2,43.37) 65.91,43.37 66.11,43.17 v1(66.11,41.93)
RX0: length 100
  Top Layer w0.153: v1(68.76,97.02) 69.74,97.02 70.32,97.6 U31.28 ; 17.81,48.91 17.66,49.06 17.66,53.97 18.13,54.44 29.29,54.44 30.05,55.2 30.05,68.61 31.34,69.9 63.81,69.9 64.24,70.34 v1(64.24,96.97)
  Bottom Layer w0.153: v1(64.24,96.97) 64.29,97.02 v1(68.76,97.02)
RX1: length 62.4
  Top Layer w0.153: U21.3 17.82,38.43 17.82,41.68 18.21,42.07 v1(24.58,42.07) ; v1(24.6,72.36) 24.6,91.59 24.87,91.86 U31.10
  Bottom Layer w0.153: v1(24.58,42.07) 24.59,42.08 24.59,72.35 v1(24.6,72.36)
SCL1: length 79.7
  Top Layer w0.153: v1(75.45,59.53) 75.45,60.44 75.64,60.64 78.4,60.64 78.55,60.79 78.55,90.57 79.79,91.81 91.91,91.81 92.55,92.45 92.55,102.16 92.4,102.31 R7.2 87.98,102.31 U18.3 ; v1(73.54,59.54) 73.29,59.8 60.94,59.8 60.16,60.57 U31.67
  Bottom Layer w0.153: v1(73.54,59.54) 73.55,59.53 v1(75.45,59.53)
SCL2: length 88.8
  Top Layer w0.153: v1(21.6,100) v1(21.6,72.38) ; U31.4 22.39,107.1 21.63,106.34 v1(21.63,101.99) ; v1(5.65,42.21) 4.51,42.21 R10.2
  Top Layer w0.3: H1.6 4.35,42.33 R10.2
  Bottom Layer w0.153: v1(5.65,42.21) 6.26,42.82 6.26,55.63 6.95,56.32 21.14,56.32 21.6,56.78 v1(21.6,72.38) ; v1(21.6,100) 21.63,100.03 v1(21.63,101.99)
SDA1: length 79.9
  Top Layer w0.153: v1(76.12,60.1) 78.81,60.1 78.93,60.22 78.93,90.37 80.01,91.46 92.06,91.46 92.94,92.34 92.94,104.79 92.79,104.94 91.43,104.94 R8.2 91.38,104.89 U18.4 ; U31.68 62.7,60.4 62.95,60.15 74.01,60.15 v1(74.03,60.13)
  Bottom Layer w0.153: v1(76.12,60.1) 74.06,60.1 v1(74.03,60.13)
SDA2: length 88.8
  Top Layer w0.153: v1(22.28,72.75) 22.28,100.17 v1(22.29,100.18) ; v1(6.4,39.77) R9.2 ; v1(22.3,101.57) 22.3,104.17 22.69,104.56 U31.5
  Top Layer w0.3: R9.2 1.87,39.77 H1.5
  Bottom Layer w0.153: v1(22.28,72.75) 22.28,55.83 21.8,55.35 7.78,55.35 7.06,54.63 7.06,40.43 v1(6.4,39.77) ; v1(22.3,101.57) 22.3,100.19 v1(22.29,100.18)
SW:
  vias: v1(68.85,26.1) v1(68.84,25.53) v1(68.81,24.96) v1(69.48,26.1) v1(69.47,25.53) v1(69.48,24.98) v1(72.7,28.72)
TX0: length 104.6
  Top Layer w0.153: 15.21,48.5 15.12,48.58 15.12,54.41 15.51,54.8 29.01,54.8 29.69,55.48 29.69,68.75 31.19,70.25 63.37,70.25 63.61,70.49 v1(63.61,99.47) ; U31.27 70.31,99.49 68.73,99.49
  Bottom Layer w0.153: 63.61,99.48 68.71,99.48 v1(68.73,99.49)
TX1: length 62
  Top Layer w0.153: U21.2 20.32,38.43 20.32,40.76 20.95,41.39 v1(23.56,41.39) ; v1(23.82,72.76) 23.82,93.97 24.25,94.4 U31.9
  Bottom Layer w0.153: v1(23.82,72.76) 23.83,72.76 23.83,41.66 v1(23.56,41.39)
$1N3300: length 3.1
  Top Layer w0.3: R1.1 18.16,81.23 U3.13
$1N3306: length 3.6
  Top Layer w0.3: U4.13 96.16,81.23 R2.1
$1N3954: length 2.5
  Top Layer w0.153: R3.1 52.68,76.35 U19.9
$1N3999: length 2.3
  Top Layer w0.153: R4.1 53.13,77.62 U19.10
$1N4038: length 2.3
  Top Layer w0.153: R5.1 51.06,81.39 U19.13
$1N7178: length 3.6
  Top Layer w0.3: Q1.1 35.53,47.46 R46.2 35.52,49.17 33.69,49.17
$1N9172: length 1.9
  Top Layer w0.3: LED2.2 73.1,36.27 71.3,36.27
$1N14720: length 5.9
  Top Layer w0.3: BUZZER3.1 38.41,39.88 38.41,45.69
$1N14723: length 6.1
  Top Layer w0.3: Q1.3 34.59,41.21 33.44,40.06 BUZZER3.2
$1N15095: length 2
  Top Layer w0.3: R59.1 86.04,54.28 86.05,54.29
$1N22095: length 6.2
  Top Layer w0.3: BUZZER4.1 81.3,37.14 80.63,37.81 R60.2
$1N22604: length 2
  Top Layer w0.3: C10.2 62.17,40.4 U28.2
$1N22844: length 2
  Top Layer w0.3: R62.1 U28.7
$1N22851: length 19
  Top Layer w0.3: R61.2 74.92,37.8 v1(74.92,39.21) 74.93,39.2 81.86,39.2 82.59,39.93 BUZZER4.2 ; v1(68.99,39.21) 67.66,39.21 U28.6
  Bottom Layer w0.3: v1(74.92,39.21) v1(68.99,39.21)
$1N30930: length 1.9
  Top Layer w0.3: C17.2 69.4,27.7 U34.6
$1N30948: length 18.1
  Top Layer w0.3: v1(64.3,31.24) 66.35,31.24 R67.2 66.48,31.37 C13.2 ; v1(64.26,18.25) 65.26,18.25 65.32,18.31
  Bottom Layer w0.3: v1(64.26,18.25) 64.26,31.2 v1(64.3,31.24)
$1N30951: length 2.8
  Top Layer w0.3: LED1.2 60.41,18.27 63.07,18.27

## Copper pours and planes (outline as drawn; the poured copper is in the pictures)
5V on Top Layer: 66.55,38.27 71.8,38.27 71.8,37.26 66.55,37.26
5V on Top Layer: 70.78,47.52 72.32,47.52 72.32,37.25 70.78,37.25
5V on Top Layer: 66.55,38.27 71.8,38.27 71.8,37.26 66.55,37.26
5V on Top Layer: 70.78,47.52 72.32,47.52 72.32,37.25 70.78,37.25
12V on Top Layer: 84.25,32.5 93.46,32.5 93.46,28.52 84.25,28.52
12V on Top Layer: 76.67,32.54 89.06,32.54 89.06,28.53 76.67,28.53
12V on Bottom Layer: 76.67,32.54 89.06,32.54 89.06,28.53 76.67,28.53
12V on Bottom Layer: 84.25,32.5 93.46,32.5 93.46,28.52 84.25,28.52
+3.3V on Top Layer: 75.14,53.06 85.82,53.06 85.82,46.95 75.14,46.95
+3.3V on Bottom Layer: 75.17,53.08 85.85,53.08 85.85,46.97 75.17,46.97
+3.3V on Inner2: -5.07,12.69 102.35,12.69 102.35,119.07 -5.07,119.07
+12V on Top Layer: 94.11,33.17 96.4,33.17 96.4,24.99 94.11,24.99
+12V on Bottom Layer: 94.11,33.17 96.4,33.17 96.4,24.99 94.11,24.99
GND on Top Layer: 57.8,45.3 65.55,45.3 65.55,35.33 57.8,35.33
GND on Top Layer: 71.37,28.06 88.11,28.06 88.11,17.39 71.37,17.39
GND on Top Layer: 57.8,45.3 65.55,45.3 65.55,35.33 57.8,35.33
GND on Top Layer: -12.53,115.54 104.34,115.54 104.34,13.93 -12.53,13.93
GND on Top Layer: 63.14,44.36 70.15,44.36 70.15,41.51 63.14,41.51
GND on Top Layer: 66.83,18.84 82.67,18.84 82.67,17.39 66.83,17.39
GND on Top Layer: 64.06,36.88 70.07,36.88 70.07,35.47 64.06,35.47
GND on Top Layer: 64.06,36.88 70.07,36.88 70.07,35.47 64.06,35.47
GND on Top Layer: 70.56,31.78 72.33,31.78 72.33,27.44 70.56,27.44
GND on Bottom Layer: -16.21,116.91 108.42,116.91 108.42,15.31 -16.21,15.31
GND on Inner1: 0.5,116.02 99.5,116.02 99.5,17.02 0.5,17.02
GND on Inner1: 0.5,47.02 1.69,47.02 1.69,42.72 0.5,42.72
(no net) on Bottom Layer: 71.45,33 75.18,33 75.18,28.73 71.45,28.73
DC5V on Top Layer: 64.66,23.16 73.53,23.16 73.53,19.34 64.66,19.34
DC5V on Top Layer: 59.37,38.31 63.67,38.31 63.67,35.4 59.37,35.4
DC5V on Top Layer: 62.55,20.27 65.8,20.27 65.8,19.33 62.55,19.33
DC5V on Top Layer: 61.21,36.54 65.79,36.54 65.79,19.32 61.21,19.32
DC5V on Top Layer: 59.37,38.31 63.67,38.31 63.67,35.4 59.37,35.4
DC5V on Bottom Layer: 64.71,23.16 73.58,23.16 73.58,19.34 64.71,19.34
DC12V on Top Layer: 86.24,28.41 93.53,28.41 93.53,17.33 86.24,17.33
DC12V on Bottom Layer: 86.28,28.38 93.57,28.38 93.57,17.3 86.28,17.3
SW on Top Layer: 71.47,29 73.4,29 73.4,28.45 71.47,28.45
SW on Top Layer: 66.65,26.4 73.41,26.4 73.41,24.66 66.65,24.66
SW on Bottom Layer: 66.72,29.02 73.42,29.02 73.42,24.66 66.72,24.66
$1N17140 on Top Layer: 73.03,47.43 80.15,47.43 80.15,45.8 73.03,45.8
$1N30940 on Top Layer: 71.46,33 75.18,33 75.18,28.74 71.46,28.74

Small or netless copper shapes (teardrops, artwork), in the pictures only: 363 on Top Layer, 120 on Bottom Layer, 105 on Inner1, 40 on Inner2

## Text on the board
Top Silkscreen Layer: 3.3V | GND | SCL2 | SDA2 | SCL | TX/PA10 | SDA | RX/PB3 | RX/PA11 | RST | TX/PB2 | DC | CS | 蜂鸣器 | 报警蜂鸣器 | 5V | SDA1 | SCL1 | M1_02 | M1_E2 | M2_01 | M2_E1 | M1_01 | M1_E1 | M2_02 | M2_E2 | M4_E2 | M3-E2 | M4_02 | M4_01 | M4_E1 | M3-01 | M3-02 | M3-E1 | TB6612 | I2C循迹板 | 电池接口 | 左前 | 左后 | 蓝牙模块 | OLED屏幕 | 维特陀螺仪/视觉 | 右后 | 开关 | 右前 | MPU6050 & IMU660RA
